# Altium schematic sheet in3ator.SchDoc: Main
size A3; Date: 17/09/18; Author: Pablo Sánchez Bergasa; Revision: 2.A.1; SheetNumber: 1; SheetTotal: 10; DocumentName: Main
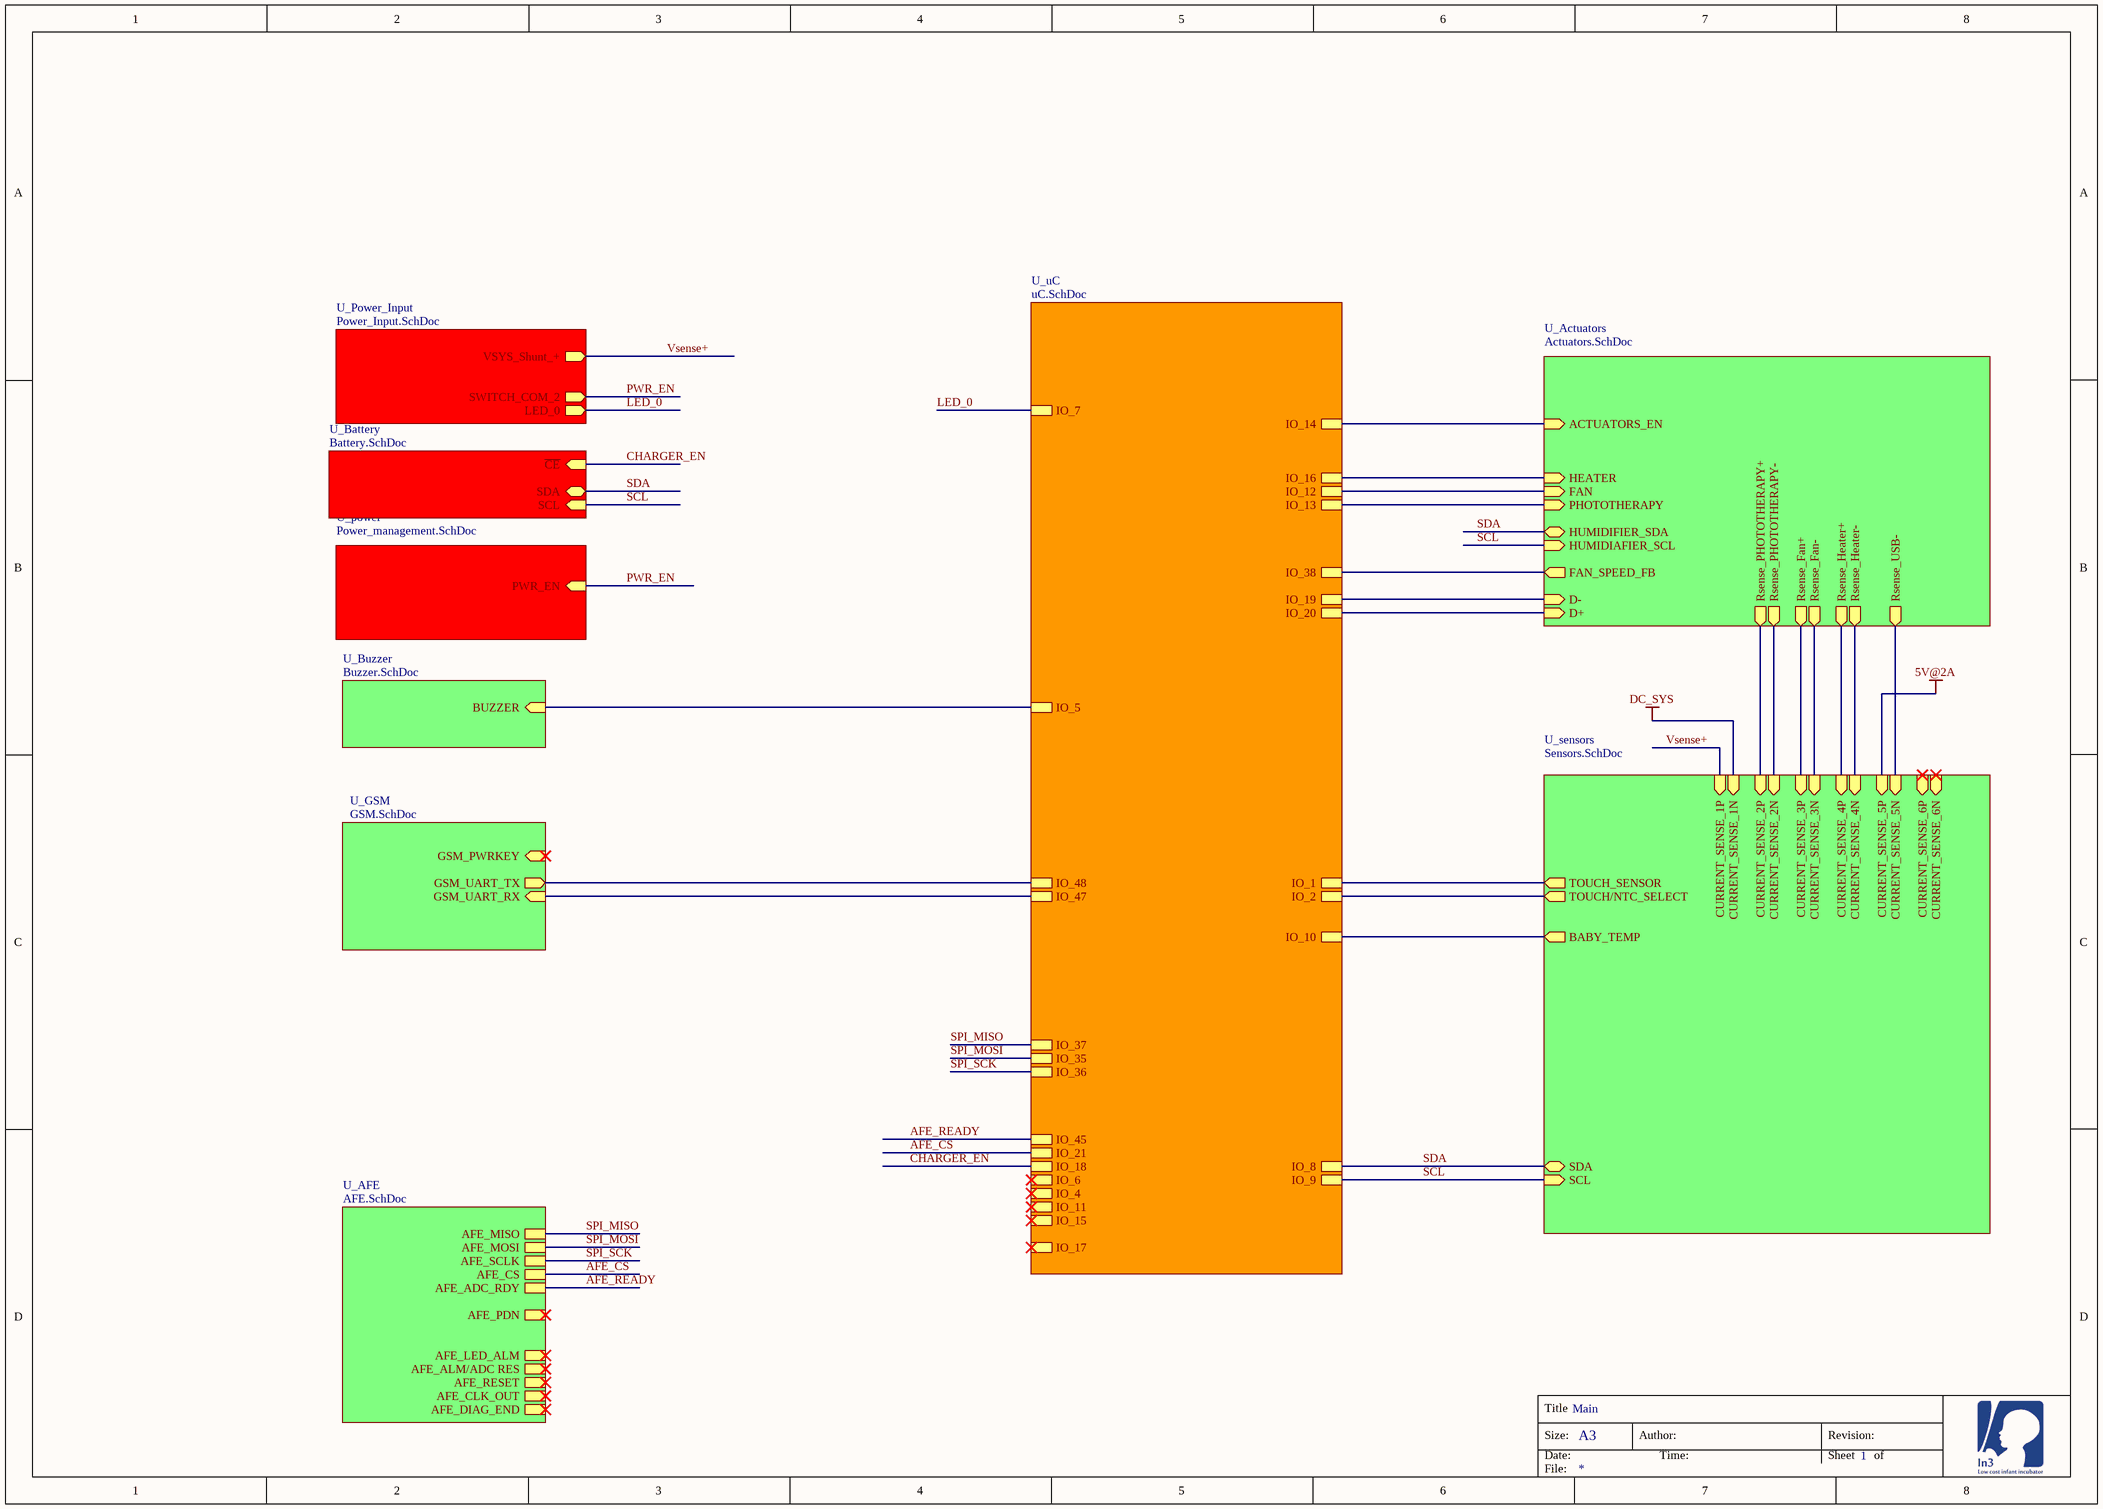
[diagram p0: in3ator.SchDoc]

## Sub-sheets
U_Actuators = Actuators.SchDoc: HEATER (in), PHOTOTHERAPY (in), FAN (in), Rsense_Fan+ (out), Rsense_Fan- (out), Rsense_PHOTOTHERAPY+ (out), Rsense_PHOTOTHERAPY- (out), ACTUATORS_EN (in), HUMIDIFIER_SDA (bidir), HUMIDIAFIER_SCL (in), FAN_SPEED_FB (out), Rsense_Heater- (out), Rsense_Heater+ (out), Rsense_USB- (out), D- (in), D+ (in)
U_AFE = AFE.SchDoc: AFE_SCLK, AFE_MISO, AFE_MOSI, AFE_CS, AFE_PDN, AFE_ADC_RDY, AFE_RESET, AFE_DIAG_END, AFE_LED_ALM, AFE_ALM/ADC RES, AFE_CLK_OUT
U_Battery = Battery.SchDoc: SDA (bidir), SCL (in), ~{CE} (in)
U_Buzzer = Buzzer.SchDoc: BUZZER (in)
U_GSM = GSM.SchDoc: GSM_UART_TX (out), GSM_UART_RX (in), GSM_PWRKEY (in)
U_power = Power_management.SchDoc: PWR_EN (in)
U_Power_Input = Power_Input.SchDoc: VSYS_Shunt_+ (out), SWITCH_COM_2 (out), LED_0 (out)
U_sensors = Sensors.SchDoc: BABY_TEMP (out), CURRENT_SENSE_1N (in), CURRENT_SENSE_3N (in), CURRENT_SENSE_2N (in), CURRENT_SENSE_1P (in), CURRENT_SENSE_3P (in), CURRENT_SENSE_2P (in), SCL (in), SDA (bidir), CURRENT_SENSE_6P (in), CURRENT_SENSE_5N (in), CURRENT_SENSE_4P (in), CURRENT_SENSE_4N (in), CURRENT_SENSE_6N (in), CURRENT_SENSE_5P (in), TOUCH/NTC_SELECT (out), TOUCH_SENSOR (out)
U_uC = uC.SchDoc: IO_5, IO_13, IO_14, IO_12, IO_35, IO_37, IO_2, IO_19, IO_36, IO_8, IO_9, IO_1, IO_20, IO_7, IO_38, IO_21, IO_45, IO_15, IO_18, IO_4, IO_11, IO_16, IO_17, IO_48, IO_47, IO_6, IO_10

## Nets
5V@2A: sheet U_sensors/CURRENT_SENSE_5P
DC_SYS: sheet U_sensors/CURRENT_SENSE_1N
AFE_CS: sheet U_uC/IO_21, sheet U_AFE/AFE_CS
AFE_READY: sheet U_uC/IO_45, sheet U_AFE/AFE_ADC_RDY
CHARGER_EN: sheet U_uC/IO_18, sheet U_Battery/~{CE}
LED_0: sheet U_uC/IO_7, sheet U_Power_Input/LED_0
PWR_EN: sheet U_power/PWR_EN, sheet U_Power_Input/SWITCH_COM_2
SCL: sheet U_sensors/SCL, sheet U_uC/IO_9, sheet U_Actuators/HUMIDIAFIER_SCL, sheet U_Battery/SCL
SDA: sheet U_sensors/SDA, sheet U_uC/IO_8, sheet U_Actuators/HUMIDIFIER_SDA, sheet U_Battery/SDA
SPI_MISO: sheet U_uC/IO_37, sheet U_AFE/AFE_MISO
SPI_MOSI: sheet U_uC/IO_35, sheet U_AFE/AFE_MOSI
SPI_SCK: sheet U_uC/IO_36, sheet U_AFE/AFE_SCLK
Vsense+: sheet U_sensors/CURRENT_SENSE_1P, sheet U_Power_Input/VSYS_Shunt_+
(unnamed): sheet U_GSM/GSM_UART_TX, sheet U_uC/IO_48
(unnamed): sheet U_GSM/GSM_UART_RX, sheet U_uC/IO_47
(unnamed): sheet U_sensors/BABY_TEMP, sheet U_uC/IO_10
(unnamed): sheet U_sensors/CURRENT_SENSE_3N, sheet U_Actuators/Rsense_Fan-
(unnamed): sheet U_sensors/CURRENT_SENSE_2N, sheet U_Actuators/Rsense_PHOTOTHERAPY-
(unnamed): sheet U_sensors/CURRENT_SENSE_3P, sheet U_Actuators/Rsense_Fan+
(unnamed): sheet U_sensors/CURRENT_SENSE_2P, sheet U_Actuators/Rsense_PHOTOTHERAPY+
(unnamed): sheet U_sensors/CURRENT_SENSE_5N, sheet U_Actuators/Rsense_USB-
(unnamed): sheet U_sensors/CURRENT_SENSE_4P, sheet U_Actuators/Rsense_Heater+
(unnamed): sheet U_sensors/CURRENT_SENSE_4N, sheet U_Actuators/Rsense_Heater-
(unnamed): sheet U_sensors/TOUCH/NTC_SELECT, sheet U_uC/IO_2
(unnamed): sheet U_sensors/TOUCH_SENSOR, sheet U_uC/IO_1
(unnamed): sheet U_uC/IO_5, sheet U_Buzzer/BUZZER
(unnamed): sheet U_uC/IO_13, sheet U_Actuators/PHOTOTHERAPY
(unnamed): sheet U_uC/IO_14, sheet U_Actuators/ACTUATORS_EN
(unnamed): sheet U_uC/IO_12, sheet U_Actuators/FAN
(unnamed): sheet U_uC/IO_19, sheet U_Actuators/D-
(unnamed): sheet U_uC/IO_20, sheet U_Actuators/D+
(unnamed): sheet U_uC/IO_38, sheet U_Actuators/FAN_SPEED_FB
(unnamed): sheet U_uC/IO_16, sheet U_Actuators/HEATER

## Notes on the sheet
- Title
- Size:
- Date:
- A3
- Author:
- Time:
- Revision:
- Sheet
- of
- File: